# Altium project roach2_project rev2.PrjPCB (part 11 of 13)

## Sheet v6_net.SchDoc: Virtex-6 Gigabit Ethernet
size A3; Date: DO NOT USE, RATHER USE PROJ OPTIONS; DrawnBy: DO NOT USE, RATHER USE PROJ OPTIONS; Engineer: DO NOT USE, RATHER USE PROJ OPTIONS; Organization: DO NOT USE, RATHER USE PROJ OPTIONS; DocumentNumber: DO NOT USE, RATHER USE PROJ OPTIONS; Revision: DO NOT USE, RATHER USE PROJ OPTIONS; SheetNumber: 23; SheetTotal: 27; SCH_Sheet_Filename: v6_net.SchDoc; CurrentTime: DO NOT USE, RATHER USE PROJ OPTIONS; Time: DO NOT USE, RATHER USE PROJ OPTIONS; DocumentFullPathAndName: DO NOT USE, RATHER USE PROJ OPTIONS; DocumentName: DO NOT USE, RATHER USE PROJ OPTIONS; ModifiedDate: DO NOT USE, RATHER USE PROJ OPTIONS; ImagePath: DO NOT USE, RATHER USE PROJ OPTIONS
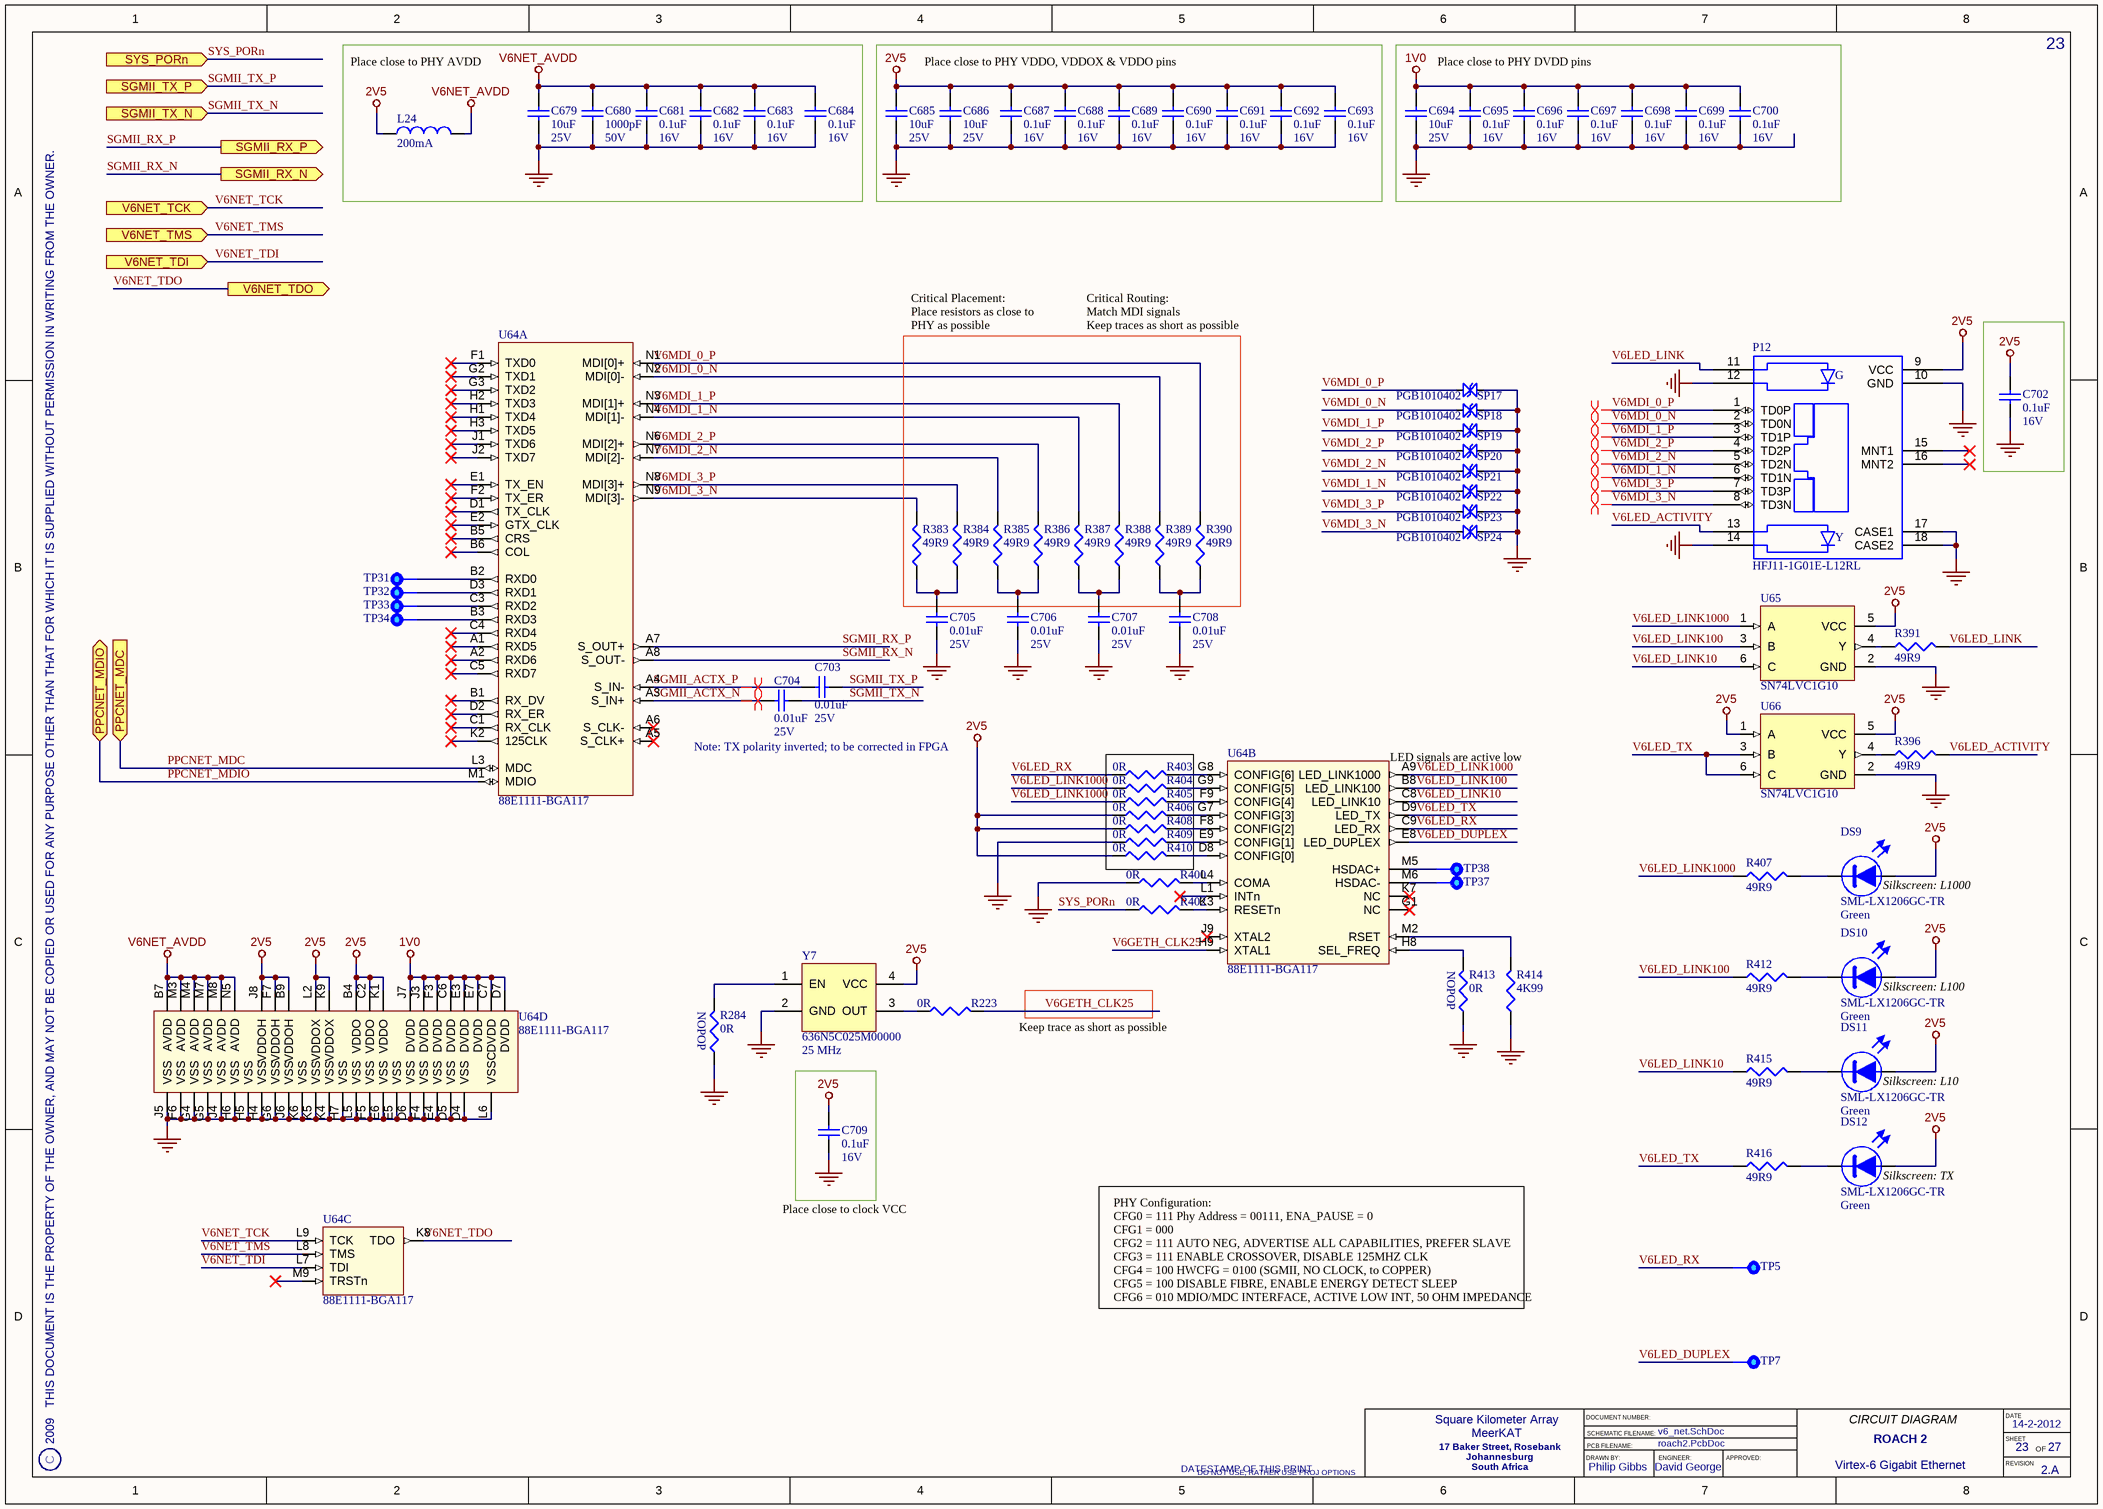
[diagram p21: v6_net.SchDoc]

### Parts
C679  Rating: 25V  [CAPC3225X200L]  (hidden comment: 10uF)
C680  Rating: 50V  [CAPC1005X55L]  (hidden comment: 1000pF)
C681  Rating: 16V  [CAPC1005X60L]  (hidden comment: 0.1uF)
C682  Rating: 16V  [CAPC1005X60L]  (hidden comment: 0.1uF)
C683  Rating: 16V  [CAPC1005X60L]  (hidden comment: 0.1uF)
C684  Rating: 16V  [CAPC1005X60L]  (hidden comment: 0.1uF)
C685  Rating: 25V  [CAPC3225X200L]  (hidden comment: 10uF)
C686  Rating: 25V  [CAPC3225X200L]  (hidden comment: 10uF)
C687  Rating: 16V  [CAPC1005X60L]  (hidden comment: 0.1uF)
C688  Rating: 16V  [CAPC1005X60L]  (hidden comment: 0.1uF)
C689  Rating: 16V  [CAPC1005X60L]  (hidden comment: 0.1uF)
C690  Rating: 16V  [CAPC1005X60L]  (hidden comment: 0.1uF)
C691  Rating: 16V  [CAPC1005X60L]  (hidden comment: 0.1uF)
C692  Rating: 16V  [CAPC1005X60L]  (hidden comment: 0.1uF)
C693  Rating: 16V  [CAPC1005X60L]  (hidden comment: 0.1uF)
C694  Rating: 25V  [CAPC3225X200L]  (hidden comment: 10uF)
C695  Rating: 16V  [CAPC1005X60L]  (hidden comment: 0.1uF)
C696  Rating: 16V  [CAPC1005X60L]  (hidden comment: 0.1uF)
C697  Rating: 16V  [CAPC1005X60L]  (hidden comment: 0.1uF)
C698  Rating: 16V  [CAPC1005X60L]  (hidden comment: 0.1uF)
C699  Rating: 16V  [CAPC1005X60L]  (hidden comment: 0.1uF)
C700  Rating: 16V  [CAPC1005X60L]  (hidden comment: 0.1uF)
C702  Rating: 16V  [CAPC1005X60L]  (hidden comment: 0.1uF)
C703  Rating: 25V  [CAPC1005X55L]  (hidden comment: 0.01uF)
C704  Rating: 25V  [CAPC1005X55L]  (hidden comment: 0.01uF)
C705  Rating: 25V  [CAPC1005X55L]  (hidden comment: 0.01uF)
C706  Rating: 25V  [CAPC1005X55L]  (hidden comment: 0.01uF)
C707  Rating: 25V  [CAPC1005X55L]  (hidden comment: 0.01uF)
C708  Rating: 25V  [CAPC1005X55L]  (hidden comment: 0.01uF)
C709  Rating: 16V  [CAPC1005X60L]  (hidden comment: 0.1uF)
DS9  SML-LX1206GC-TR  Colour: Green  [LEDC3216X120N]
DS10  SML-LX1206GC-TR  Colour: Green  [LEDC3216X120N]
DS11  SML-LX1206GC-TR  Colour: Green  [LEDC3216X120N]
DS12  SML-LX1206GC-TR  Colour: Green  [LEDC3216X120N]
L24  Rating: 200mA  [INDC2012X130L]  (hidden comment: 600R)
P12  HFJ11-1G01E-L12RL  [HALO_HFJ11-1G02E-L55]
R223  0R  [RESC1005X40L]
R284  0R  [RESC1005X40L]
R383  49R9  [RESC1005X40L]
R384  49R9  [RESC1005X40L]
R385  49R9  [RESC1005X40L]
R386  49R9  [RESC1005X40L]
R387  49R9  [RESC1005X40L]
R388  49R9  [RESC1005X40L]
R389  49R9  [RESC1005X40L]
R390  49R9  [RESC1005X40L]
R391  49R9  [RESC1005X40L]
R396  49R9  [RESC1005X40L]
R400  0R  [RESC1005X40L]
R402  0R  [RESC1005X40L]
R403  0R  [RESC1005X40L]
R404  0R  [RESC1005X40L]
R405  0R  [RESC1005X40L]
R406  0R  [RESC1005X40L]
R407  49R9  [RESC1005X40L]
R408  0R  [RESC1005X40L]
R409  0R  [RESC1005X40L]
R410  0R  [RESC1005X40L]
R412  49R9  [RESC1005X40L]
R413  0R  [RESC1005X40L]
R414  4K99  [RESC1005X40L]
R415  49R9  [RESC1005X40L]
R416  49R9  [RESC1005X40L]
SP17  PGB1010402  [PGB1010402]
SP18  PGB1010402  [PGB1010402]
SP19  PGB1010402  [PGB1010402]
SP20  PGB1010402  [PGB1010402]
SP21  PGB1010402  [PGB1010402]
SP22  PGB1010402  [PGB1010402]
SP23  PGB1010402  [PGB1010402]
SP24  PGB1010402  [PGB1010402]
TP5  Testpoint  [TP100]  (value not drawn)  (no BOM)
TP7  Testpoint  [TP100]  (value not drawn)  (no BOM)
TP31  Testpoint  [TP100]  (value not drawn)  (no BOM)
TP32  Testpoint  [TP100]  (value not drawn)  (no BOM)
TP33  Testpoint  [TP100]  (value not drawn)  (no BOM)
TP34  Testpoint  [TP100]  (value not drawn)  (no BOM)
TP37  Testpoint  [TP100]  (value not drawn)  (no BOM)
TP38  Testpoint  [TP100]  (value not drawn)  (no BOM)
U64  88E1111-BGA117  [BGA117C100P13X9_1400X1000X154]  (parts A,B,C,D of 4)
U65  SN74LVC1G10  [SOT23-6]
U66  SN74LVC1G10  [SOT23-6]
Y7  Frequency: 25 MHz  [636XXXXXXMXXXXX]  (hidden comment: 636N5C025M00000)

### Ports
PPCNET_MDC (in), PPCNET_MDIO (bidir), SGMII_RX_N (out), SGMII_RX_P (out), SGMII_TX_N (in), SGMII_TX_P (in), SYS_PORn (in), V6NET_TCK (in), V6NET_TDI (in), V6NET_TDO (out), V6NET_TMS (in)

### Nets
1V0: C694.2 C695.2 C696.2 C697.2 C698.2 C699.2 C700.2 U64.C6(DVDD) U64.C7(DVDD) U64.D7(DVDD) U64.E3(DVDD) U64.E7(DVDD) U64.F3(DVDD) U64.J3(DVDD) U64.J7(DVDD)
2V5: C685.2 C686.2 C687.2 C688.2 C689.2 C690.2 C691.2 C692.2 C693.2 C702.2 C709.2 DS9.2(A) DS10.2(A) DS11.2(A) DS12.2(A) L24.1 P12.9(VCC) R406.1 R408.1 R410.1 U64.B4(VDDO) U64.B9(VDDOH) U64.C2(VDDO) U64.F7(VDDOH) U64.J8(VDDOH) U64.K1(VDDO) U64.K9(VDDOX) U64.L2(VDDOX) U65.5(VCC) U66.1(A) U66.5(VCC) Y7.4(VCC)
GND: C679.1 C680.1 C681.1 C682.1 C683.1 C684.1 C685.1 C686.1 C687.1 C688.1 C689.1 C690.1 C691.1 C692.1 C693.1 C694.1 C695.1 C696.1 C697.1 C698.1 C699.1 C700.1 C702.1 C705.2 C706.2 C707.2 C708.2 C709.1 P12.10(GND) P12.12(R1_YA_GC) P12.14(L1_YA_GC) P12.17(CASE1) P12.18(CASE2) R284.1 R400.1 R409.1 R413.1 R414.1 SP17.1(A) SP18.1(A) SP19.1(A) SP20.1(A) SP21.1(A) SP22.1(A) SP23.1(A) SP24.1(A) U64.D4(VSS) U64.D5(VSS) U64.D6(VSS) U64.E4(VSS) U64.E5(VSS) U64.E6(VSS) U64.F4(VSS) U64.F5(VSS) U64.F6(VSS) U64.G4(VSS) U64.G5(VSS) U64.G6(VSS) U64.H4(VSS) U64.H5(VSS) U64.H6(VSS) U64.H7(VSS) U64.J4(VSS) U64.J5(VSS) U64.J6(VSS) U64.K4(VSS) U64.K5(VSS) U64.K6(VSS) U64.L5(VSS) U64.L6(VSSC) U65.2(GND) U66.2(GND) Y7.2(GND)
V6NET_AVDD: C679.2 C680.2 C681.2 C682.2 C683.2 C684.2 L24.2 U64.B7(AVDD) U64.M3(AVDD) U64.M4(AVDD) U64.M7(AVDD) U64.M8(AVDD) U64.N5(AVDD)
PPCNET_MDC: U64.L3(MDC) ; port PPCNET_MDC
PPCNET_MDIO: U64.M1(MDIO) ; port PPCNET_MDIO
SGMII_ACTX_N: C704.2 U64.A3(S_IN+)
SGMII_ACTX_P: C703.2 U64.A4(S_IN-)
SGMII_RX_N: U64.A8(S_OUT-) ; port SGMII_RX_N
SGMII_RX_P: U64.A7(S_OUT+) ; port SGMII_RX_P
SGMII_TX_N: C704.1 ; port SGMII_TX_N
SGMII_TX_P: C703.1 ; port SGMII_TX_P
SYS_PORn: R402.1 ; port SYS_PORn
V6GETH_CLK25: R223.2 U64.H9(XTAL1)
V6LED_ACTIVITY: P12.13(L1_YC_GA) R396.2
V6LED_DUPLEX: TP7.1 U64.E8(LED_DUPLEX)
V6LED_LINK: P12.11(R1_YC_GA) R391.2
V6LED_LINK10: R415.1 U64.C8(LED_LINK10) U65.6(C)
V6LED_LINK100: R412.1 U64.B8(LED_LINK100) U65.3(B)
V6LED_LINK1000: R404.1 R405.1 R407.1 U64.A9(LED_LINK1000) U65.1(A)
V6LED_RX: R403.1 TP5.1 U64.C9(LED_RX)
V6LED_TX: R416.1 U64.D9(LED_TX) U66.3(B) U66.6(C)
V6MDI_0_N: P12.2(TD0N) R389.2 SP18.2(B) U64.N2(MDI[0]-)
V6MDI_0_P: P12.1(TD0P) R390.2 SP17.2(B) U64.N1(MDI[0]+)
V6MDI_1_N: P12.6(TD1N) R387.2 SP22.2(B) U64.N4(MDI[1]-)
V6MDI_1_P: P12.3(TD1P) R388.2 SP19.2(B) U64.N3(MDI[1]+)
V6MDI_2_N: P12.5(TD2N) R385.2 SP21.2(B) U64.N7(MDI[2]-)
V6MDI_2_P: P12.4(TD2P) R386.2 SP20.2(B) U64.N6(MDI[2]+)
V6MDI_3_N: P12.8(TD3N) R383.2 SP24.2(B) U64.N9(MDI[3]-)
V6MDI_3_P: P12.7(TD3P) R384.2 SP23.2(B) U64.N8(MDI[3]+)
V6NET_TCK: U64.L9(TCK) ; port V6NET_TCK
V6NET_TDI: U64.L7(TDI) ; port V6NET_TDI
V6NET_TDO: U64.K8(TDO) ; port V6NET_TDO
V6NET_TMS: U64.L8(TMS) ; port V6NET_TMS
NetC705_1: C705.1 R383.1 R384.1
NetC706_1: C706.1 R385.1 R386.1
NetC707_1: C707.1 R387.1 R388.1
NetC708_1: C708.1 R389.1 R390.1
NetDS9_1: DS9.1(K) R407.2
NetDS10_1: DS10.1(K) R412.2
NetDS11_1: DS11.1(K) R415.2
NetDS12_1: DS12.1(K) R416.2
NetR223_1: R223.1 Y7.3(OUT)
NetR284_2: R284.2 Y7.1(EN)
NetR391_1: R391.1 U65.4(Y)
NetR396_1: R396.1 U66.4(Y)
NetR400_2: R400.2 U64.L4(COMA)
NetR402_2: R402.2 U64.K3(RESETn)
NetR403_2: R403.2 U64.G8(CONFIG[6])
NetR404_2: R404.2 U64.G9(CONFIG[5])
NetR405_2: R405.2 U64.F9(CONFIG[4])
NetR406_2: R406.2 U64.G7(CONFIG[3])
NetR408_2: R408.2 U64.F8(CONFIG[2])
NetR409_2: R409.2 U64.E9(CONFIG[1])
NetR410_2: R410.2 U64.D8(CONFIG[0])
NetR413_2: R413.2 U64.H8(SEL_FREQ)
NetR414_2: R414.2 U64.M2(RSET)
NetTP31_1: TP31.1 U64.B2(RXD0)
NetTP32_1: TP32.1 U64.D3(RXD1)
NetTP33_1: TP33.1 U64.C3(RXD2)
NetTP34_1: TP34.1 U64.B3(RXD3)
NetTP37_1: TP37.1 U64.M6(HSDAC-)
NetTP38_1: TP38.1 U64.M5(HSDAC+)

Not connected (* = marked no-connect by the designer): P12 15(MNT1)* 16(MNT2)*; U64 A1(RXD5)* A2(RXD6)* A5(S_CLK+)* A6(S_CLK-)* B1(RX_DV)* B5(CRS)* B6(COL)* C1(RX_CLK)* C4(RXD4)* C5(RXD7)* D1(TX_CLK)* D2(RX_ER)* E1(TX_EN)* E2(GTX_CLK)* F1(TXD0)* F2(TX_ER)* G1(NC)* G2(TXD1)* G3(TXD2)* H1(TXD4)* H2(TXD3)* H3(TXD5)* J1(TXD6)* J2(TXD7)* J9(XTAL2)* K2(125CLK)* K7(NC)* L1(INTn)* M9(TRSTn)*

### Layout directives
differential pair: SGMII_ACTX_N, SGMII_ACTX_P, V6MDI_0_N, V6MDI_0_P, V6MDI_1_N, V6MDI_1_P, V6MDI_2_N, V6MDI_2_P, V6MDI_3_N, V6MDI_3_P

### Notes on the sheet
- Place close to PHY AVDD
- Place close to PHY VDDO, VDDOX & VDDO pins
- Place close to PHY DVDD pins
- Critical Placement:
  Place resistors as close to
  PHY as possible
- Critical Routing:
  Match MDI signals
  Keep traces as short as possible
- Note: TX polarity inverted; to be corrected in FPGA
- (near U64) LED signals are active low
- (near DS9) Silkscreen: L1000
- (near R413) NOPOP
- (near DS10) Silkscreen: L100
- (near R284) NOPOP
- (near R223) Keep trace as short as possible
- (near DS11) Silkscreen: L10
- (near DS12) Silkscreen: TX
- Place close to clock VCC
- PHY Configuration:
  CFG0 = 111 Phy Address = 00111, ENA_PAUSE = 0
  CFG1 = 000
  CFG2 = 111 AUTO NEG, ADVERTISE ALL CAPABILITIES, PREFER SLAVE
  CFG3 = 111 ENABLE CROSSOVER, DISABLE 125MHZ CLK
  CFG4 = 100 HWCFG = 0100 (SGMII, NO CLOCK, to COPPER)
  CFG5 = 100 DISABLE FIBRE, ENABLE ENERGY DETECT SLEEP
  CFG6 = 010 MDIO/MDC INTERFACE, ACTIVE LOW INT, 50 OHM IMPEDANCE
- 2009   THIS DOCUMENT IS THE PROPERTY OF THE OWNER, AND MAY NOT BE COPIED OR USED FOR ANY PURPOSE OTHER THAN THAT FOR WHICH IT IS SUPPLIED WITHOUT PERMISSION IN WRITING FROM THE OWNER.
- C
- DATESTAMP OF THIS PRINT
- DRAWN BY:
- DOCUMENT NUMBER:
- SCHEMATIC FILENAME:
- PCB FILENAME:
- ENGINEER:
- APPROVED:
- CIRCUIT DIAGRAM
- DATE
- SHEET
- REVISION
- OF
- (in symbol CONN-PCB-4) G

### Library data of the parts
C679 C685 C686 C694 = CAP-CER-5: 10uF, Ceramic Capacitor; Manufacturer: MURATA; PartNum: GRM32DR61E106KA12L; Tolerance: 10%; Dielectric: X5R; POD number: CAP-CER-5; Value: 10uF; RoHS: Y; Sort Value: 100; Category: Capacitors; Subcategory: Ceramic
C680 = CAP-CER-4: 1000pF, Ceramic Capacitor; Manufacturer: MURATA; PartNum: GRM155R61H102KA01D; Tolerance: 10%; Dielectric: X5R; POD number: CAP-CER-4; Value: 1000pF; RoHS: Y; Sort Value: 0.0001; Category: Capacitors; Subcategory: Ceramic
C681-C684 C687-C693 C695-C700 C702 C709 = CAP-CER-1: 0.1uF, Ceramic Capacitor; Manufacturer: VENKEL; PartNum: C0402X7R160-104KN; Tolerance: 10%; Dielectric: X7R; POD number: CAP-CER-1; Value: 0.1uF; RoHS: Y; Sort Value: 0.1; Category: Capacitors; Subcategory: Ceramic
C703-C708 = CAP-CER-6: 0.01uF, Ceramic Capacitor; Manufacturer: MURATA; PartNum: GRM155R71E103KA01D; Tolerance: 10%; Dielectric: X7R; POD number: CAP-CER-6; Value: 0.01uF; RoHS: Y; Sort Value: 0.01; Category: Capacitors; Subcategory: Ceramic
DS9-DS12 = OPTO-LED-0: Green, Surface mount, LED, 1206; Manufacturer: LUMEX; Vdrop: 2.2V; Rating: 20mA; POD number: OPTO-LED-0; PartNum: SML-LX1206GC-TR; RoHS: Y; Category: OPTO; Subcategory: LED
L24 = IND-FB-0: 600 Ohm, Chip Ferrite Bead; Manufacturer: Murata; PartNum: BLM21BD601SN1; DC Res: 0.35R; Tolerance: 25%; POD number: IND-FB-0; RoHS: Y; Value: 600R; Sort Value: 600; Category: Inductors; Subcategory: FerriteBead
P12 = CONN-PCB-4: RJ45 with Integrated magnetic and dual LEDs; Manufacturer: HALO; POD number: CONN-PCB-4; PartNum: HFJ11-1G01E-L12RL; RoHS: Y; Category: CONN; Subcategory: PCB
R223 R284 R400 R402-R406 R408-R410 R413 = RES-TF-0: 0R, 1.1mm x 0.5mm, Thick Film Resistor; Manufacturer: ROYALOHM; PartNum: 0402WG00000T1E; Tolerance: 0%; Rating: 0.0625W; POD number: RES-TF-0; Value: 0R; Sort Value: 0; Category: Resistors; Subcategory: ThickFilm; HelpURL: *.pdf
R383-R391 R396 R407 R412 R415 R416 = RES-TF-10: 49R9, 1.1mm x 0.5mm, Thick Film Resistor; Manufacturer: ROYALOHM; PartNum: 0402WGF499JT1E; Tolerance: 1%; Rating: 0.0625W; POD number: RES-TF-10; Value: 49R9; Sort Value: 49.9; Category: Resistors; Subcategory: ThickFilm; HelpURL: *.pdf
R414 = RES-TF-13: 4K99, 1.1mm x 0.5mm, Thick Film Resistor; Manufacturer: ROYALOHM; PartNum: 0402WGF4991T1E; Tolerance: 1%; Rating: 0.0625W; POD number: RES-TF-13; Value: 4K99; Sort Value: 4990; Category: Resistors; Subcategory: ThickFilm; HelpURL: *.pdf
SP17-SP24 = ELMECH-ESD-3: Surface Mount Polymeric ESD Suppressor in an 0402 package; POD number: ELMECH-ESD-3; PartNum: PGB1010402
TP5 TP7 TP31-TP34 TP37 TP38 = ELMECH-TP-0: 1mm Diameter, through-hole, Circular Test-point; POD number: ELMECH-TP-0; RoHS: Y; Category: ELMECH; Subcategory: Test Points
U64 = IC-PHY-1: Integrated 10/100/1000 Ultra Gigabit Ethernet Transceiver; Manufacturer: Marvell; PartNum: 88E1111-XX-BAB1C000; POD number: IC-PHY-1; RoHS: Y; Category: IC; Subcategory: Network PHY
U65 U66 = IC-LOG-3: Single 3-input Positive-NAND gate; Manufacturer: Texas Instruments; POD number: IC-LOG-3; PartNum: SN74LVC1G10; RoHS: Y; Category: IC; Subcategory: Logic
Y7 = RESN-CLK-5: 25.00 MHz, 2V5, CTS 636 clock oscillator; Stability: 50 PPM; POD number: RESN-CLK-5; PartNum: 636N5C025M00000; Manufacturer: CTS; RoHS: Y; Category: RESN; Subcategory: Clock Oscillators

## Sheet ppc_ddr2_0.SchDoc: PowerPC DDR2 Interface
size A3; Date: DO NOT USE, RATHER USE PROJ OPTIONS; DrawnBy: DO NOT USE, RATHER USE PROJ OPTIONS; Engineer: DO NOT USE, RATHER USE PROJ OPTIONS; Organization: DO NOT USE, RATHER USE PROJ OPTIONS; DocumentNumber: DO NOT USE, RATHER USE PROJ OPTIONS; Revision: DO NOT USE, RATHER USE PROJ OPTIONS; SheetNumber: 8; SheetTotal: 27; SCH_Sheet_Filename: ppc_ddr2_0.SchDoc; CurrentTime: DO NOT USE, RATHER USE PROJ OPTIONS; Time: DO NOT USE, RATHER USE PROJ OPTIONS; DocumentFullPathAndName: DO NOT USE, RATHER USE PROJ OPTIONS; DocumentName: DO NOT USE, RATHER USE PROJ OPTIONS; ModifiedDate: DO NOT USE, RATHER USE PROJ OPTIONS; ImagePath: DO NOT USE, RATHER USE PROJ OPTIONS
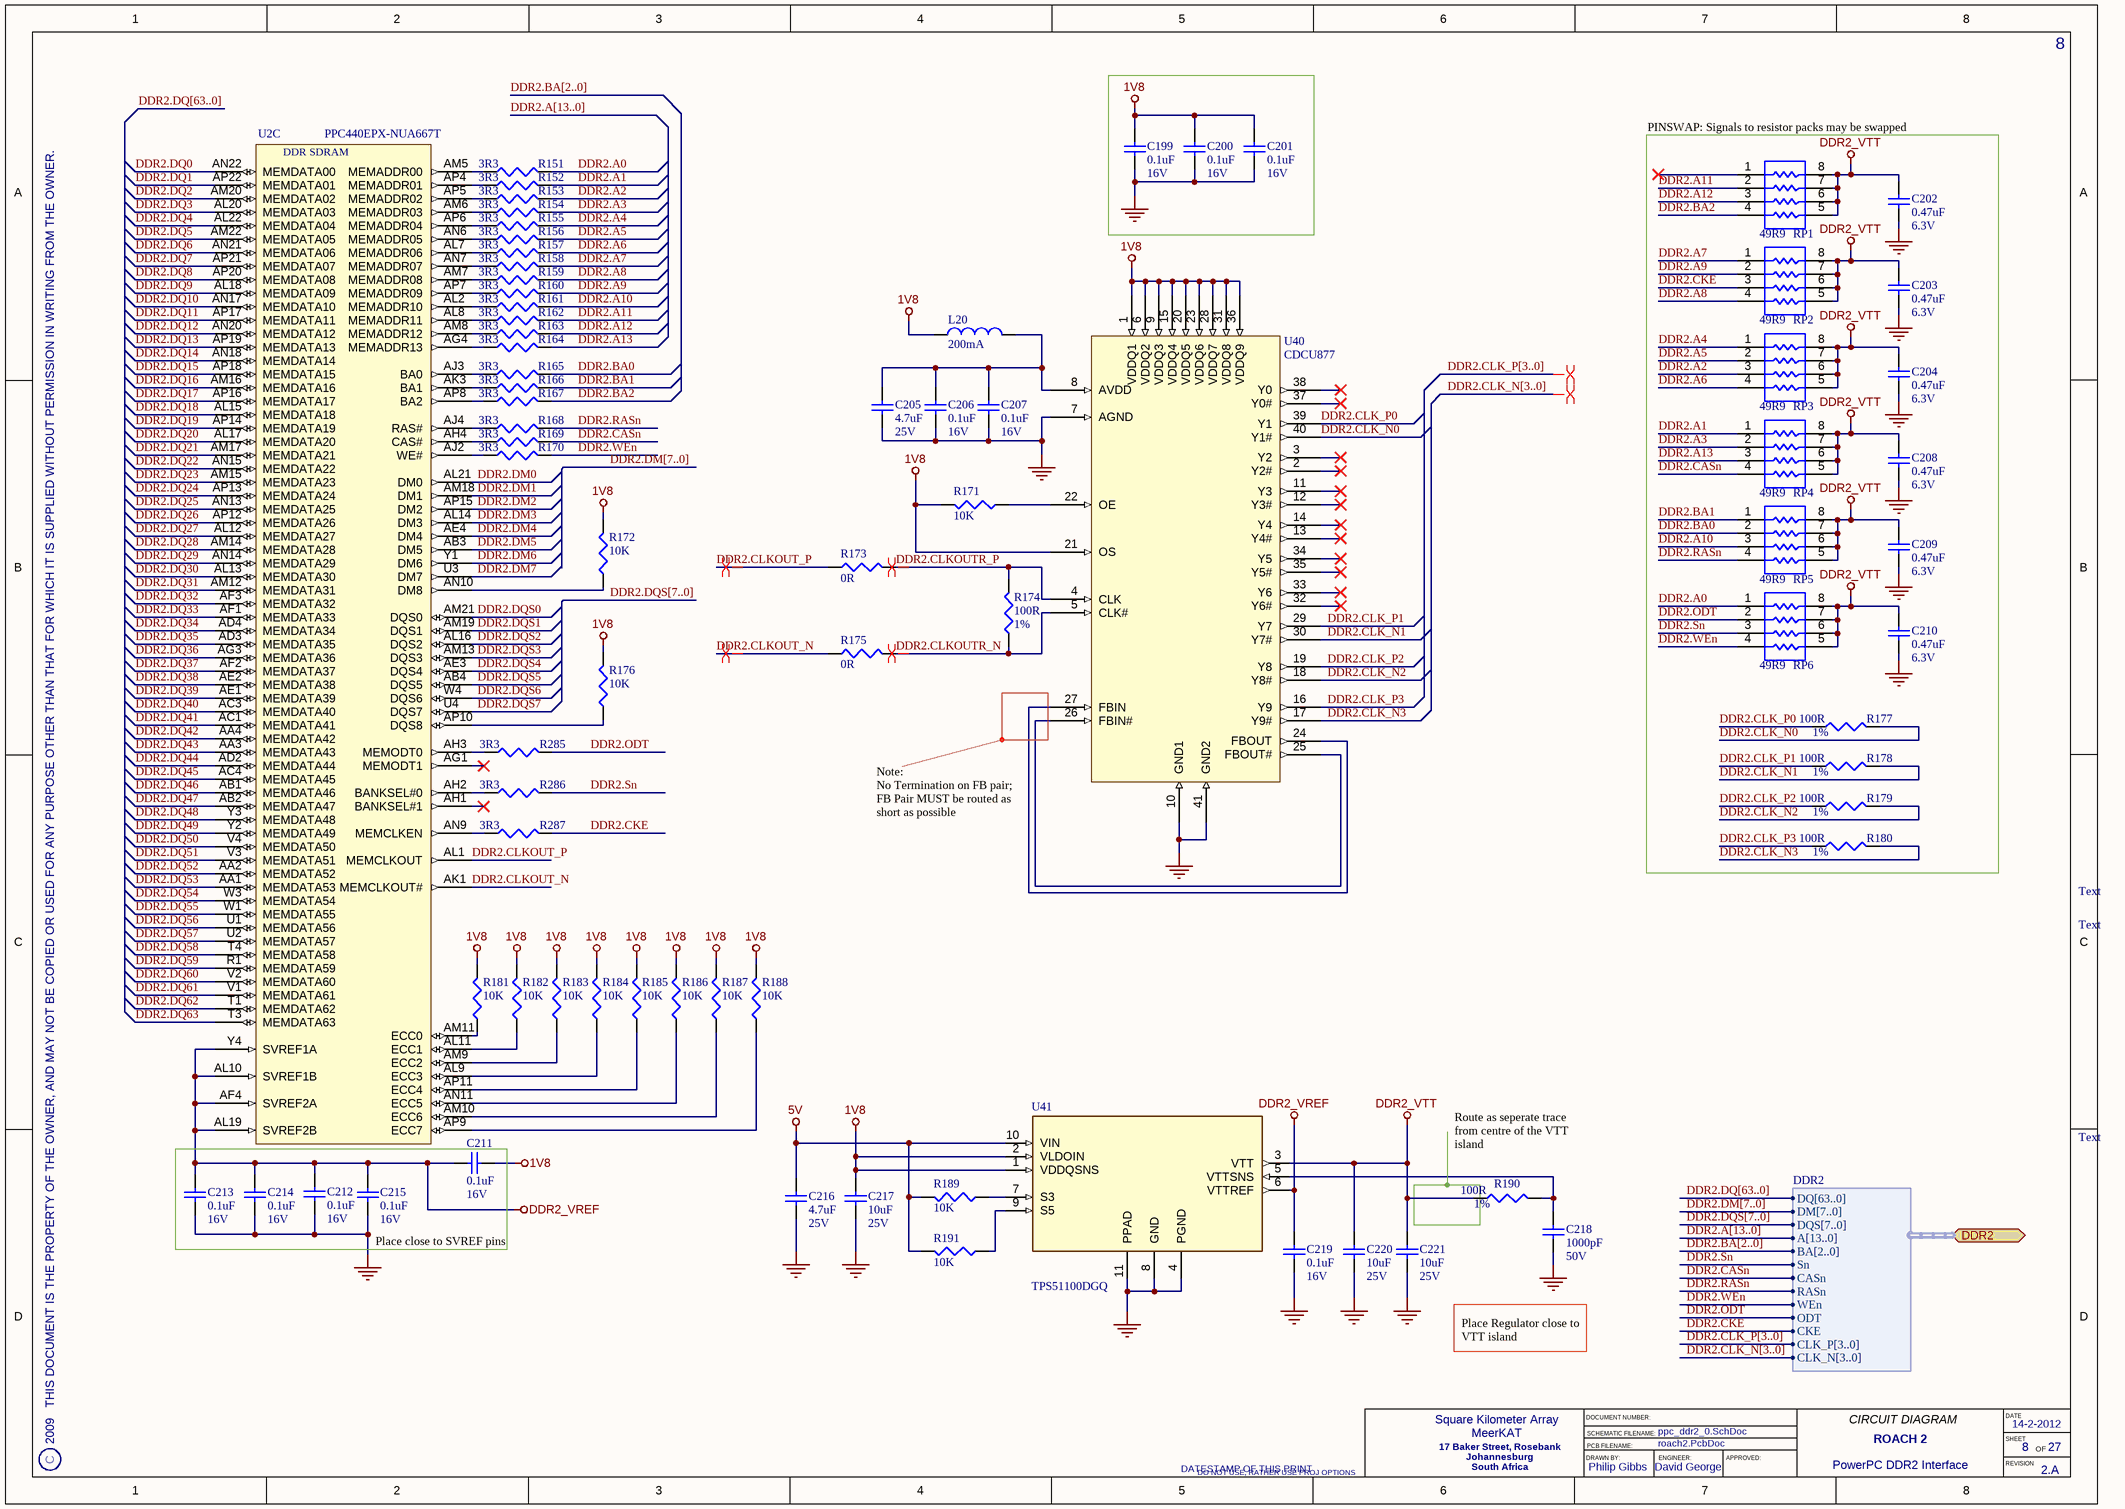
[diagram p22: ppc_ddr2_0.SchDoc]

### Parts
C199  Rating: 16V  [CAPC1005X60L]  (hidden comment: 0.1uF)
C200  Rating: 16V  [CAPC1005X60L]  (hidden comment: 0.1uF)
C201  Rating: 16V  [CAPC1005X60L]  (hidden comment: 0.1uF)
C202  Rating: 6.3V  [CAPC1005X55L]  (hidden comment: 0.47uF)
C203  Rating: 6.3V  [CAPC1005X55L]  (hidden comment: 0.47uF)
C204  Rating: 6.3V  [CAPC1005X55L]  (hidden comment: 0.47uF)
C205  Rating: 25V  [CAPC2012X127L]  (hidden comment: 4.7uF)
C206  Rating: 16V  [CAPC1005X60L]  (hidden comment: 0.1uF)
C207  Rating: 16V  [CAPC1005X60L]  (hidden comment: 0.1uF)
C208  Rating: 6.3V  [CAPC1005X55L]  (hidden comment: 0.47uF)
C209  Rating: 6.3V  [CAPC1005X55L]  (hidden comment: 0.47uF)
C210  Rating: 6.3V  [CAPC1005X55L]  (hidden comment: 0.47uF)
C211  Rating: 16V  [CAPC1005X60L]  (hidden comment: 0.1uF)
C212  Rating: 16V  [CAPC1005X60L]  (hidden comment: 0.1uF)
C213  Rating: 16V  [CAPC1005X60L]  (hidden comment: 0.1uF)
C214  Rating: 16V  [CAPC1005X60L]  (hidden comment: 0.1uF)
C215  Rating: 16V  [CAPC1005X60L]  (hidden comment: 0.1uF)
C216  Rating: 25V  [CAPC2012X127L]  (hidden comment: 4.7uF)
C217  Rating: 25V  [CAPC3225X200L]  (hidden comment: 10uF)
C218  Rating: 50V  [CAPC1005X55L]  (hidden comment: 1000pF)
C219  Rating: 16V  [CAPC1005X60L]  (hidden comment: 0.1uF)
C220  Rating: 25V  [CAPC3225X200L]  (hidden comment: 10uF)
C221  Rating: 25V  [CAPC3225X200L]  (hidden comment: 10uF)
L20  Rating: 200mA  [INDC2012X130L]  (hidden comment: 600R)
R151  3R3  [RESC1005X40L]
R152  3R3  [RESC1005X40L]
R153  3R3  [RESC1005X40L]
R154  3R3  [RESC1005X40L]
R155  3R3  [RESC1005X40L]
R156  3R3  [RESC1005X40L]
R157  3R3  [RESC1005X40L]
R158  3R3  [RESC1005X40L]
R159  3R3  [RESC1005X40L]
R160  3R3  [RESC1005X40L]
R161  3R3  [RESC1005X40L]
R162  3R3  [RESC1005X40L]
R163  3R3  [RESC1005X40L]
R164  3R3  [RESC1005X40L]
R165  3R3  [RESC1005X40L]
R166  3R3  [RESC1005X40L]
R167  3R3  [RESC1005X40L]
R168  3R3  [RESC1005X40L]
R169  3R3  [RESC1005X40L]
R170  3R3  [RESC1005X40L]
R171  10K  [RESC1005X40L]
R172  10K  [RESC1005X40L]
R173  0R  [RESC1005X40L]
R174  Tolerance: 1%  [RESC1005X40L]  (hidden comment: 100R)
R175  0R  [RESC1005X40L]
R176  10K  [RESC1005X40L]
R177  Tolerance: 1%  [RESC1005X40L]  (hidden comment: 100R)
R178  Tolerance: 1%  [RESC1005X40L]  (hidden comment: 100R)
R179  Tolerance: 1%  [RESC1005X40L]  (hidden comment: 100R)
R180  Tolerance: 1%  [RESC1005X40L]  (hidden comment: 100R)
R181  10K  [RESC1005X40L]
R182  10K  [RESC1005X40L]
R183  10K  [RESC1005X40L]
R184  10K  [RESC1005X40L]
R185  10K  [RESC1005X40L]
R186  10K  [RESC1005X40L]
R187  10K  [RESC1005X40L]
R188  10K  [RESC1005X40L]
R189  10K  [RESC1005X40L]
R190  Tolerance: 1%  [RESC1005X40L]  (hidden comment: 100R)
R191  10K  [RESC1005X40L]
R285  3R3  [RESC1005X40L]
R286  3R3  [RESC1005X40L]
R287  3R3  [RESC1005X40L]
RP1  49R9  [RESCAV50P100X200X45-8L]
RP2  49R9  [RESCAV50P100X200X45-8L]
RP3  49R9  [RESCAV50P100X200X45-8L]
RP4  49R9  [RESCAV50P100X200X45-8L]
RP5  49R9  [RESCAV50P100X200X45-8L]
RP6  49R9  [RESCAV50P100X200X45-8L]
U2  PPC440EPX-NUA667T  [TE-PBGA680]  (part C of 11)
U40  CDCU877  [TQFN-40]
U41  TPS51100DGQ  [MSOP_10-N]

### Ports
DDR2 (harness DDR2)

### Harnesses
DDR2: DQ[63..0], DM[7..0], DQS[7..0], A[13..0], BA[2..0], Sn, CASn, RASn, WEn, ODT, CKE, CLK_P[3..0], CLK_N[3..0]

### Nets
1V8: C199.2 C200.2 C201.2 C211.2 C217.2 L20.1 R171.2 R172.2 R176.2 R181.2 R182.2 R183.2 R184.2 R185.2 R186.2 R187.2 R188.2 U40.1(VDDQ1) U40.6(VDDQ2) U40.9(VDDQ3) U40.15(VDDQ4) U40.20(VDDQ5) U40.21(OS) U40.23(VDDQ6) U40.28(VDDQ7) U40.31(VDDQ8) U40.36(VDDQ9) U41.1(VDDQSNS) U41.2(VLDOIN)
5V: C216.2 R189.2 R191.2 U41.10(VIN)
DDR2_VREF: C211.1 C212.2 C213.2 C214.2 C215.2 C219.2 U2.AF4(SVREF2A) U2.AL10(SVREF1B) U2.AL19(SVREF2B) U2.Y4(SVREF1A) U41.6(VTTREF)
DDR2_VTT: C202.2 C203.2 C204.2 C208.2 C209.2 C210.2 C220.2 C221.2 R190.1 RP1.5 RP1.6 RP1.7 RP1.8 RP2.5 RP2.6 RP2.7 RP2.8 RP3.5 RP3.6 RP3.7 RP3.8 RP4.5 RP4.6 RP4.7 RP4.8 RP5.5 RP5.6 RP5.7 RP5.8 RP6.5 RP6.6 RP6.7 RP6.8 U41.3(VTT)
GND: C199.1 C200.1 C201.1 C202.1 C203.1 C204.1 C205.1 C206.1 C207.1 C208.1 C209.1 C210.1 C212.1 C213.1 C214.1 C215.1 C216.1 C217.1 C218.1 C219.1 C220.1 C221.1 U40.7(AGND) U40.10(GND1) U40.41(GND2) U41.4(PGND) U41.8(GND) U41.11(PPAD)
DDR2.A0: R151.2 RP6.1
DDR2.A1: R152.2 RP4.1
DDR2.A2: R153.2 RP3.3
DDR2.A3: R154.2 RP4.2
DDR2.A4: R155.2 RP3.1
DDR2.A5: R156.2 RP3.2
DDR2.A6: R157.2 RP3.4
DDR2.A7: R158.2 RP2.1
DDR2.A8: R159.2 RP2.4
DDR2.A9: R160.2 RP2.2
DDR2.A10: R161.2 RP5.3
DDR2.A11: R162.2 RP1.2
DDR2.A12: R163.2 RP1.3
DDR2.A13: R164.2 RP4.3
DDR2.BA0: R165.2 RP5.2
DDR2.BA1: R166.2 RP5.1
DDR2.BA2: R167.2 RP1.4
DDR2.CASn: R169.2 RP4.4 ; port DDR2.CASn
DDR2.CKE: R287.2 RP2.3 ; port DDR2.CKE
DDR2.CLK_N0: R177.2 U40.40(Y1#)
DDR2.CLK_N1: R178.2 U40.30(Y7#)
DDR2.CLK_N2: R179.2 U40.18(Y8#)
DDR2.CLK_N3: R180.2 U40.17(Y9#)
DDR2.CLK_P0: R177.1 U40.39(Y1)
DDR2.CLK_P1: R178.1 U40.29(Y7)
DDR2.CLK_P2: R179.1 U40.19(Y8)
DDR2.CLK_P3: R180.1 U40.16(Y9)
DDR2.CLKOUT_N: R175.1 U2.AK1(MEMCLKOUT#)
DDR2.CLKOUT_P: R173.1 U2.AL1(MEMCLKOUT)
DDR2.CLKOUTR_N: R174.1 R175.2 U40.5(CLK#)
DDR2.CLKOUTR_P: R173.2 R174.2 U40.4(CLK)
DDR2.DM0: U2.AL21(DM0)
DDR2.DM1: U2.AM18(DM1)
DDR2.DM2: U2.AP15(DM2)
DDR2.DM3: U2.AL14(DM3)
DDR2.DM4: U2.AE4(DM4)
DDR2.DM5: U2.AB3(DM5)
DDR2.DM6: U2.Y1(DM6)
DDR2.DM7: U2.U3(DM7)
DDR2.DQ0: U2.AN22(MEMDATA00)
DDR2.DQ1: U2.AP22(MEMDATA01)
DDR2.DQ2: U2.AM20(MEMDATA02)
DDR2.DQ3: U2.AL20(MEMDATA03)
DDR2.DQ4: U2.AL22(MEMDATA04)
DDR2.DQ5: U2.AM22(MEMDATA05)
DDR2.DQ6: U2.AN21(MEMDATA06)
DDR2.DQ7: U2.AP21(MEMDATA07)
DDR2.DQ8: U2.AP20(MEMDATA08)
DDR2.DQ9: U2.AL18(MEMDATA09)
DDR2.DQ10: U2.AN17(MEMDATA10)
DDR2.DQ11: U2.AP17(MEMDATA11)
DDR2.DQ12: U2.AN20(MEMDATA12)
DDR2.DQ13: U2.AP19(MEMDATA13)
DDR2.DQ14: U2.AN18(MEMDATA14)
DDR2.DQ15: U2.AP18(MEMDATA15)
DDR2.DQ16: U2.AM16(MEMDATA16)
DDR2.DQ17: U2.AP16(MEMDATA17)
DDR2.DQ18: U2.AL15(MEMDATA18)
DDR2.DQ19: U2.AP14(MEMDATA19)
DDR2.DQ20: U2.AL17(MEMDATA20)
DDR2.DQ21: U2.AM17(MEMDATA21)
DDR2.DQ22: U2.AN15(MEMDATA22)
DDR2.DQ23: U2.AM15(MEMDATA23)
DDR2.DQ24: U2.AP13(MEMDATA24)
DDR2.DQ25: U2.AN13(MEMDATA25)
DDR2.DQ26: U2.AP12(MEMDATA26)
DDR2.DQ27: U2.AL12(MEMDATA27)
DDR2.DQ28: U2.AM14(MEMDATA28)
DDR2.DQ29: U2.AN14(MEMDATA29)
DDR2.DQ30: U2.AL13(MEMDATA30)
DDR2.DQ31: U2.AM12(MEMDATA31)
DDR2.DQ32: U2.AF3(MEMDATA32)
DDR2.DQ33: U2.AF1(MEMDATA33)
DDR2.DQ34: U2.AD4(MEMDATA34)
DDR2.DQ35: U2.AD3(MEMDATA35)
DDR2.DQ36: U2.AG3(MEMDATA36)
DDR2.DQ37: U2.AF2(MEMDATA37)
DDR2.DQ38: U2.AE2(MEMDATA38)
DDR2.DQ39: U2.AE1(MEMDATA39)
DDR2.DQ40: U2.AC3(MEMDATA40)
DDR2.DQ41: U2.AC1(MEMDATA41)
DDR2.DQ42: U2.AA4(MEMDATA42)
DDR2.DQ43: U2.AA3(MEMDATA43)
DDR2.DQ44: U2.AD2(MEMDATA44)
DDR2.DQ45: U2.AC4(MEMDATA45)
DDR2.DQ46: U2.AB1(MEMDATA46)
DDR2.DQ47: U2.AB2(MEMDATA47)
DDR2.DQ48: U2.Y3(MEMDATA48)
DDR2.DQ49: U2.Y2(MEMDATA49)
DDR2.DQ50: U2.V4(MEMDATA50)
DDR2.DQ51: U2.V3(MEMDATA51)
DDR2.DQ52: U2.AA2(MEMDATA52)
DDR2.DQ53: U2.AA1(MEMDATA53)
DDR2.DQ54: U2.W3(MEMDATA54)
DDR2.DQ55: U2.W1(MEMDATA55)
DDR2.DQ56: U2.U1(MEMDATA56)
DDR2.DQ57: U2.U2(MEMDATA57)
DDR2.DQ58: U2.T4(MEMDATA58)
DDR2.DQ59: U2.R1(MEMDATA59)
DDR2.DQ60: U2.V2(MEMDATA60)
DDR2.DQ61: U2.V1(MEMDATA61)
DDR2.DQ62: U2.T1(MEMDATA62)
DDR2.DQ63: U2.T3(MEMDATA63)
DDR2.DQS0: U2.AM21(DQS0)
DDR2.DQS1: U2.AM19(DQS1)
DDR2.DQS2: U2.AL16(DQS2)
DDR2.DQS3: U2.AM13(DQS3)
DDR2.DQS4: U2.AE3(DQS4)
DDR2.DQS5: U2.AB4(DQS5)
DDR2.DQS6: U2.W4(DQS6)
DDR2.DQS7: U2.U4(DQS7)
DDR2.ODT: R285.2 RP6.2 ; port DDR2.ODT
DDR2.RASn: R168.2 RP5.4 ; port DDR2.RASn
DDR2.Sn: R286.2 RP6.3 ; port DDR2.Sn
DDR2.WEn: R170.2 RP6.4 ; port DDR2.WEn
NetC205_2: C205.2 C206.2 C207.2 L20.2 U40.8(AVDD)
NetC218_2: C218.2 R190.2 U41.5(VTTSNS)
NetR151_1: R151.1 U2.AM5(MEMADDR00)
NetR152_1: R152.1 U2.AP4(MEMADDR01)
NetR153_1: R153.1 U2.AP5(MEMADDR02)
NetR154_1: R154.1 U2.AM6(MEMADDR03)
NetR155_1: R155.1 U2.AP6(MEMADDR04)
NetR156_1: R156.1 U2.AN6(MEMADDR05)
NetR157_1: R157.1 U2.AL7(MEMADDR06)
NetR158_1: R158.1 U2.AN7(MEMADDR07)
NetR159_1: R159.1 U2.AM7(MEMADDR08)
NetR160_1: R160.1 U2.AP7(MEMADDR09)
NetR161_1: R161.1 U2.AL2(MEMADDR10)
NetR162_1: R162.1 U2.AL8(MEMADDR11)
NetR163_1: R163.1 U2.AM8(MEMADDR12)
NetR164_1: R164.1 U2.AG4(MEMADDR13)
NetR165_1: R165.1 U2.AJ3(BA0)
NetR166_1: R166.1 U2.AK3(BA1)
NetR167_1: R167.1 U2.AP8(BA2)
NetR168_1: R168.1 U2.AJ4(RAS#)
NetR169_1: R169.1 U2.AH4(CAS#)
NetR170_1: R170.1 U2.AJ2(WE#)
NetR171_1: R171.1 U40.22(OE)
NetR172_1: R172.1 U2.AN10(DM8)
NetR176_1: R176.1 U2.AP10(DQS8)
NetR181_1: R181.1 U2.AM11(ECC0)
NetR182_1: R182.1 U2.AL11(ECC1)
NetR183_1: R183.1 U2.AM9(ECC2)
NetR184_1: R184.1 U2.AL9(ECC3)
NetR185_1: R185.1 U2.AP11(ECC4)
NetR186_1: R186.1 U2.AN11(ECC5)
NetR187_1: R187.1 U2.AM10(ECC6)
NetR188_1: R188.1 U2.AP9(ECC7)
NetR189_1: R189.1 U41.7(S3)
NetR191_1: R191.1 U41.9(S5)
NetR285_1: R285.1 U2.AH3(MEMODT0)
NetR286_1: R286.1 U2.AH2(BANKSEL#0)
NetR287_1: R287.1 U2.AN9(MEMCLKEN)
NetU40_24: U40.24(FBOUT) U40.27(FBIN)
NetU40_25: U40.25(FBOUT#) U40.26(FBIN#)

Not connected (* = marked no-connect by the designer): RP1 1*; U2 AG1(MEMODT1)* AH1(BANKSEL#1)*; U40 2(Y2#)* 3(Y2)* 11(Y3)* 12(Y3#)* 13(Y4#)* 14(Y4)* 32(Y6#)* 33(Y6)* 34(Y5)* 35(Y5#)* 37(Y0#)* 38(Y0)*

### Buses and harness runs
bus DDR2.A[13..0]
bus DDR2.BA[2..0]
bus DDR2.CLK_N[3..0]
bus DDR2.CLK_P[3..0]
bus DDR2.DM[7..0]
bus DDR2.DQ[63..0]
bus DDR2.DQS[7..0]

### Layout directives
differential pair: (no net found under the mark), DDR2.CLKOUT_N, DDR2.CLKOUT_P, DDR2.CLKOUTR_N, DDR2.CLKOUTR_P

### Notes on the sheet
- (near RP1) PINSWAP: Signals to resistor packs may be swapped
- Note:
  No Termination on FB pair;
  FB Pair MUST be routed as short as possible
- Text
- Route as seperate trace from centre of the VTT island
- (near C215) Place close to SVREF pins
- Place Regulator close to VTT island
- 2009   THIS DOCUMENT IS THE PROPERTY OF THE OWNER, AND MAY NOT BE COPIED OR USED FOR ANY PURPOSE OTHER THAN THAT FOR WHICH IT IS SUPPLIED WITHOUT PERMISSION IN WRITING FROM THE OWNER.
- C
- DATESTAMP OF THIS PRINT
- DRAWN BY:
- DOCUMENT NUMBER:
- SCHEMATIC FILENAME:
- PCB FILENAME:
- ENGINEER:
- APPROVED:
- CIRCUIT DIAGRAM
- DATE
- SHEET
- REVISION
- OF
- (in symbol IC-CPU-1, part C) DDR SDRAM

### Library data of the parts
C199-C201 C206 C207 C211-C215 C219 = CAP-CER-1: as C681-C684 on sheet v6_net; POD number: CAP-CER-1; Value: 0.1uF; RoHS: Y; Sort Value: 0.1; Category: Capacitors; Subcategory: Ceramic
C202-C204 C208-C210 = CAP-CER-7: 0.47uF, Ceramic Capacitor; Manufacturer: MURATA; PartNum: GRM155R60J474KE19; Tolerance: 10%; Dielectric: X5R; POD number: CAP-CER-7; Value: 0.47uF; RoHS: Y; Sort Value: 0.47; Category: Capacitors; Subcategory: Ceramic
C205 C216 = CAP-CER-3: 4.7uF, Ceramic Capacitor; Manufacturer: MURATA; PartNum: GRM21BR61E475KA12K; Tolerance: 10%; Dielectric: X5R; POD number: CAP-CER-3; Value: 4.7uF; RoHS: Y; Sort Value: 4.7; Category: Capacitors; Subcategory: Ceramic
C217 C220 C221 = CAP-CER-5: as C679 on sheet v6_net; POD number: CAP-CER-5; Value: 10uF; RoHS: Y; Sort Value: 100; Category: Capacitors; Subcategory: Ceramic
C218 = CAP-CER-4: as C680 on sheet v6_net; POD number: CAP-CER-4; Value: 1000pF; RoHS: Y; Sort Value: 0.0001; Category: Capacitors; Subcategory: Ceramic
L20 = IND-FB-0: as L24 on sheet v6_net; POD number: IND-FB-0; RoHS: Y; Value: 600R; Sort Value: 600; Category: Inductors; Subcategory: FerriteBead
R151-R170 R285-R287 = RES-TF-24: 3R3, 1.1mm x 0.5mm, Thick Film Resistor; Manufacturer: ROYALOHM; PartNum: 0402WGJ330KT1E; Tolerance: 5%; Rating: 0.0625W; POD number: RES-TF-24; Value: 3R3; Sort Value: 3R3; Category: Resistors; Subcategory: ThickFilm; HelpURL: *.pdf
R171 R172 R176 R181-R189 R191 = RES-TF-5: 10K, 1.1mm x 0.5mm, Thick Film Resistor; Manufacturer: ROYALOHM; PartNum: 0402WGJ0103T1E; Tolerance: 5%; Rating: 0.0625W; POD number: RES-TF-5; Value: 10K; Sort Value: 10000; Category: Resistors; Subcategory: ThickFilm; HelpURL: *.pdf
R173 R175 = RES-TF-0: as R223 on sheet v6_net; POD number: RES-TF-0; Value: 0R; Sort Value: 0; Category: Resistors; Subcategory: ThickFilm; HelpURL: *.pdf
R174 R177-R180 R190 = RES-TF-14: 100R, 1.1mm x 0.5mm, Thick Film Resistor; Manufacturer: ROYALOHM; PartNum: 0402WGF0101T1E; Rating: 0.0625W; POD number: RES-TF-14; Value: 100R; Sort Value: 1000; Category: Resistors; Subcategory: ThickFilm; HelpURL: *.pdf
RP1-RP6 = RES-TF-39: 4-Wide, Isolated, Thick Film Resistor Network; Manufacturer: ROYALOHM; PartNum: 4D02WGJ0510B1E; Tolerance: 1%; Rating: 0.0625W; POD number: RES-TF-39; Value: 49R9; Sort Value: 49.9; Category: Resistors; Subcategory: ThickFilm
U2 = IC-CPU-1: 667MHz, non-RoHS, PPC440EPx uProcessor; Manufacturer: Applied Micro; POD number: IC-CPU-1; PartNum: PPC440EPX-NUA667T; RoHS: Y; Category: IC; Subcategory: CPU
U40 = IC-LOG-15: SSTL Zero-Delay Clock Buffer; Manufacturer: Texas Instruments; POD number: IC-LOG-15; PartNum: CDCU877; RoHS: Y; Category: IC; Subcategory: Logic
U41 = IC-REG-6: 3A Sink/Source Regulator; Manufacturer: Texas Instruments; POD number: IC-REG-6; PartNum: TPS51100DGQ; RoHS: Y; Category: IC; Subcategory: Regulators

## Sheet ppc_ddr2_1.SchDoc: PowerPC DDR2 SDRAM Circuits
size A3; Date: DO NOT USE, RATHER USE PROJ OPTIONS; DrawnBy: DO NOT USE, RATHER USE PROJ OPTIONS; Engineer: DO NOT USE, RATHER USE PROJ OPTIONS; Organization: DO NOT USE, RATHER USE PROJ OPTIONS; DocumentNumber: DO NOT USE, RATHER USE PROJ OPTIONS; Revision: DO NOT USE, RATHER USE PROJ OPTIONS; SheetNumber: 9; SheetTotal: 27; SCH_Sheet_Filename: ppc_ddr2_1.SchDoc; CurrentTime: DO NOT USE, RATHER USE PROJ OPTIONS; Time: DO NOT USE, RATHER USE PROJ OPTIONS; DocumentFullPathAndName: DO NOT USE, RATHER USE PROJ OPTIONS; DocumentName: DO NOT USE, RATHER USE PROJ OPTIONS; ModifiedDate: DO NOT USE, RATHER USE PROJ OPTIONS; ImagePath: DO NOT USE, RATHER USE PROJ OPTIONS
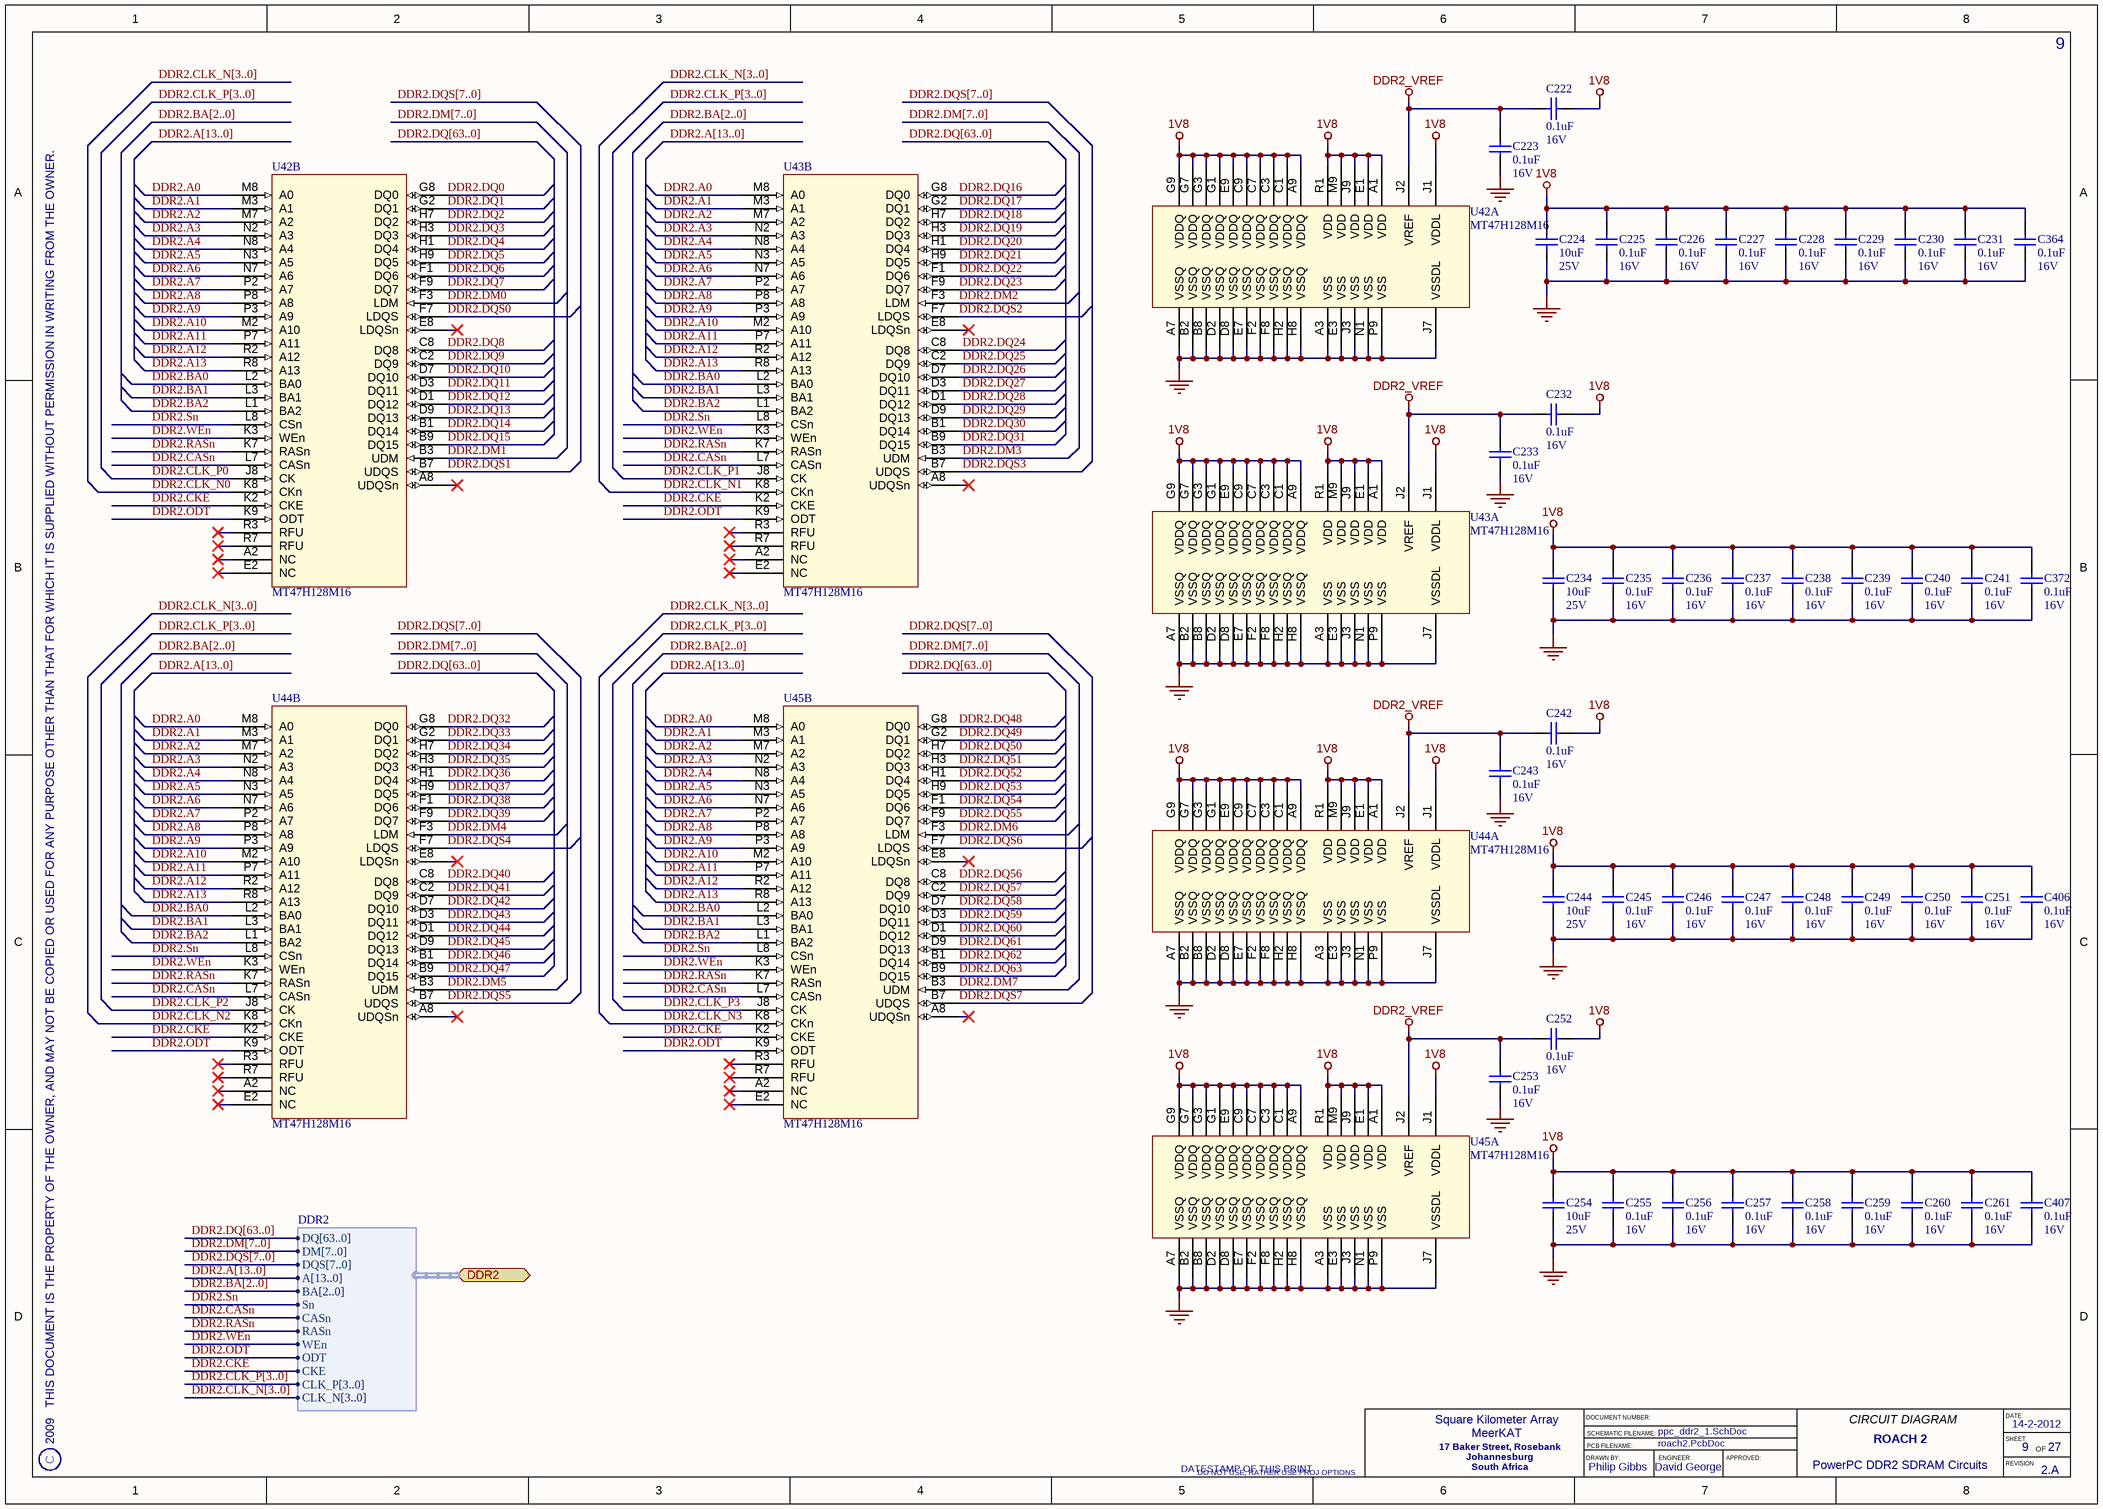
[diagram p23: ppc_ddr2_1.SchDoc]

### Parts
C222  Rating: 16V  [CAPC1005X60L]  (hidden comment: 0.1uF)
C223  Rating: 16V  [CAPC1005X60L]  (hidden comment: 0.1uF)
C224  Rating: 25V  [CAPC3225X200L]  (hidden comment: 10uF)
C225  Rating: 16V  [CAPC1005X60L]  (hidden comment: 0.1uF)
C226  Rating: 16V  [CAPC1005X60L]  (hidden comment: 0.1uF)
C227  Rating: 16V  [CAPC1005X60L]  (hidden comment: 0.1uF)
C228  Rating: 16V  [CAPC1005X60L]  (hidden comment: 0.1uF)
C229  Rating: 16V  [CAPC1005X60L]  (hidden comment: 0.1uF)
C230  Rating: 16V  [CAPC1005X60L]  (hidden comment: 0.1uF)
C231  Rating: 16V  [CAPC1005X60L]  (hidden comment: 0.1uF)
C232  Rating: 16V  [CAPC1005X60L]  (hidden comment: 0.1uF)
C233  Rating: 16V  [CAPC1005X60L]  (hidden comment: 0.1uF)
C234  Rating: 25V  [CAPC3225X200L]  (hidden comment: 10uF)
C235  Rating: 16V  [CAPC1005X60L]  (hidden comment: 0.1uF)
C236  Rating: 16V  [CAPC1005X60L]  (hidden comment: 0.1uF)
C237  Rating: 16V  [CAPC1005X60L]  (hidden comment: 0.1uF)
C238  Rating: 16V  [CAPC1005X60L]  (hidden comment: 0.1uF)
C239  Rating: 16V  [CAPC1005X60L]  (hidden comment: 0.1uF)
C240  Rating: 16V  [CAPC1005X60L]  (hidden comment: 0.1uF)
C241  Rating: 16V  [CAPC1005X60L]  (hidden comment: 0.1uF)
C242  Rating: 16V  [CAPC1005X60L]  (hidden comment: 0.1uF)
C243  Rating: 16V  [CAPC1005X60L]  (hidden comment: 0.1uF)
C244  Rating: 25V  [CAPC3225X200L]  (hidden comment: 10uF)
C245  Rating: 16V  [CAPC1005X60L]  (hidden comment: 0.1uF)
C246  Rating: 16V  [CAPC1005X60L]  (hidden comment: 0.1uF)
C247  Rating: 16V  [CAPC1005X60L]  (hidden comment: 0.1uF)
C248  Rating: 16V  [CAPC1005X60L]  (hidden comment: 0.1uF)
C249  Rating: 16V  [CAPC1005X60L]  (hidden comment: 0.1uF)
C250  Rating: 16V  [CAPC1005X60L]  (hidden comment: 0.1uF)
C251  Rating: 16V  [CAPC1005X60L]  (hidden comment: 0.1uF)
C252  Rating: 16V  [CAPC1005X60L]  (hidden comment: 0.1uF)
C253  Rating: 16V  [CAPC1005X60L]  (hidden comment: 0.1uF)
C254  Rating: 25V  [CAPC3225X200L]  (hidden comment: 10uF)
C255  Rating: 16V  [CAPC1005X60L]  (hidden comment: 0.1uF)
C256  Rating: 16V  [CAPC1005X60L]  (hidden comment: 0.1uF)
C257  Rating: 16V  [CAPC1005X60L]  (hidden comment: 0.1uF)
C258  Rating: 16V  [CAPC1005X60L]  (hidden comment: 0.1uF)
C259  Rating: 16V  [CAPC1005X60L]  (hidden comment: 0.1uF)
C260  Rating: 16V  [CAPC1005X60L]  (hidden comment: 0.1uF)
C261  Rating: 16V  [CAPC1005X60L]  (hidden comment: 0.1uF)
C364  Rating: 16V  [CAPC1005X60L]  (hidden comment: 0.1uF)
C372  Rating: 16V  [CAPC1005X60L]  (hidden comment: 0.1uF)
C406  Rating: 16V  [CAPC1005X60L]  (hidden comment: 0.1uF)
C407  Rating: 16V  [CAPC1005X60L]  (hidden comment: 0.1uF)
U42  MT47H128M16  [DDR2_BGA84]  (parts A,B of 2)
U43  MT47H128M16  [DDR2_BGA84]  (parts A,B of 2)
U44  MT47H128M16  [DDR2_BGA84]  (parts A,B of 2)
U45  MT47H128M16  [DDR2_BGA84]  (parts A,B of 2)

### Ports
DDR2 (harness DDR2)

### Harnesses
DDR2: DQ[63..0], DM[7..0], DQS[7..0], A[13..0], BA[2..0], Sn, CASn, RASn, WEn, ODT, CKE, CLK_P[3..0], CLK_N[3..0]

### Nets
1V8: C222.1 C224.2 C225.2 C226.2 C227.2 C228.2 C229.2 C230.2 C231.2 C232.1 C234.2 C235.2 C236.2 C237.2 C238.2 C239.2 C240.2 C241.2 C242.1 C244.2 C245.2 C246.2 C247.2 C248.2 C249.2 C250.2 C251.2 C252.1 C254.2 C255.2 C256.2 C257.2 C258.2 C259.2 C260.2 C261.2 C364.2 C372.2 C406.2 C407.2 U42.A1(VDD) U42.A9(VDDQ) U42.C1(VDDQ) U42.C3(VDDQ) U42.C7(VDDQ) U42.C9(VDDQ) U42.E1(VDD) U42.E9(VDDQ) U42.G1(VDDQ) U42.G3(VDDQ) U42.G7(VDDQ) U42.G9(VDDQ) U42.J1(VDDL) U42.J9(VDD) U42.M9(VDD) U42.R1(VDD) U43.A1(VDD) U43.A9(VDDQ) U43.C1(VDDQ) U43.C3(VDDQ) U43.C7(VDDQ) U43.C9(VDDQ) U43.E1(VDD) U43.E9(VDDQ) U43.G1(VDDQ) U43.G3(VDDQ) U43.G7(VDDQ) U43.G9(VDDQ) U43.J1(VDDL) U43.J9(VDD) U43.M9(VDD) U43.R1(VDD) U44.A1(VDD) U44.A9(VDDQ) U44.C1(VDDQ) U44.C3(VDDQ) U44.C7(VDDQ) U44.C9(VDDQ) U44.E1(VDD) U44.E9(VDDQ) U44.G1(VDDQ) U44.G3(VDDQ) U44.G7(VDDQ) U44.G9(VDDQ) U44.J1(VDDL) U44.J9(VDD) U44.M9(VDD) U44.R1(VDD) U45.A1(VDD) U45.A9(VDDQ) U45.C1(VDDQ) U45.C3(VDDQ) U45.C7(VDDQ) U45.C9(VDDQ) U45.E1(VDD) U45.E9(VDDQ) U45.G1(VDDQ) U45.G3(VDDQ) U45.G7(VDDQ) U45.G9(VDDQ) U45.J1(VDDL) U45.J9(VDD) U45.M9(VDD) U45.R1(VDD)
DDR2_VREF: C222.2 C223.2 C232.2 C233.2 C242.2 C243.2 C252.2 C253.2 U42.J2(VREF) U43.J2(VREF) U44.J2(VREF) U45.J2(VREF)
GND: C223.1 C224.1 C225.1 C226.1 C227.1 C228.1 C229.1 C230.1 C231.1 C233.1 C234.1 C235.1 C236.1 C237.1 C238.1 C239.1 C240.1 C241.1 C243.1 C244.1 C245.1 C246.1 C247.1 C248.1 C249.1 C250.1 C251.1 C253.1 C254.1 C255.1 C256.1 C257.1 C258.1 C259.1 C260.1 C261.1 C364.1 C372.1 C406.1 C407.1 U42.A3(VSS) U42.A7(VSSQ) U42.B2(VSSQ) U42.B8(VSSQ) U42.D2(VSSQ) U42.D8(VSSQ) U42.E3(VSS) U42.E7(VSSQ) U42.F2(VSSQ) U42.F8(VSSQ) U42.H2(VSSQ) U42.H8(VSSQ) U42.J3(VSS) U42.J7(VSSDL) U42.N1(VSS) U42.P9(VSS) U43.A3(VSS) U43.A7(VSSQ) U43.B2(VSSQ) U43.B8(VSSQ) U43.D2(VSSQ) U43.D8(VSSQ) U43.E3(VSS) U43.E7(VSSQ) U43.F2(VSSQ) U43.F8(VSSQ) U43.H2(VSSQ) U43.H8(VSSQ) U43.J3(VSS) U43.J7(VSSDL) U43.N1(VSS) U43.P9(VSS) U44.A3(VSS) U44.A7(VSSQ) U44.B2(VSSQ) U44.B8(VSSQ) U44.D2(VSSQ) U44.D8(VSSQ) U44.E3(VSS) U44.E7(VSSQ) U44.F2(VSSQ) U44.F8(VSSQ) U44.H2(VSSQ) U44.H8(VSSQ) U44.J3(VSS) U44.J7(VSSDL) U44.N1(VSS) U44.P9(VSS) U45.A3(VSS) U45.A7(VSSQ) U45.B2(VSSQ) U45.B8(VSSQ) U45.D2(VSSQ) U45.D8(VSSQ) U45.E3(VSS) U45.E7(VSSQ) U45.F2(VSSQ) U45.F8(VSSQ) U45.H2(VSSQ) U45.H8(VSSQ) U45.J3(VSS) U45.J7(VSSDL) U45.N1(VSS) U45.P9(VSS)
DDR2.A0: U42.M8(A0) U43.M8(A0) U44.M8(A0) U45.M8(A0)
DDR2.A1: U42.M3(A1) U43.M3(A1) U44.M3(A1) U45.M3(A1)
DDR2.A2: U42.M7(A2) U43.M7(A2) U44.M7(A2) U45.M7(A2)
DDR2.A3: U42.N2(A3) U43.N2(A3) U44.N2(A3) U45.N2(A3)
DDR2.A4: U42.N8(A4) U43.N8(A4) U44.N8(A4) U45.N8(A4)
DDR2.A5: U42.N3(A5) U43.N3(A5) U44.N3(A5) U45.N3(A5)
DDR2.A6: U42.N7(A6) U43.N7(A6) U44.N7(A6) U45.N7(A6)
DDR2.A7: U42.P2(A7) U43.P2(A7) U44.P2(A7) U45.P2(A7)
DDR2.A8: U42.P8(A8) U43.P8(A8) U44.P8(A8) U45.P8(A8)
DDR2.A9: U42.P3(A9) U43.P3(A9) U44.P3(A9) U45.P3(A9)
DDR2.A10: U42.M2(A10) U43.M2(A10) U44.M2(A10) U45.M2(A10)
DDR2.A11: U42.P7(A11) U43.P7(A11) U44.P7(A11) U45.P7(A11)
DDR2.A12: U42.R2(A12) U43.R2(A12) U44.R2(A12) U45.R2(A12)
DDR2.A13: U42.R8(A13) U43.R8(A13) U44.R8(A13) U45.R8(A13)
DDR2.BA0: U42.L2(BA0) U43.L2(BA0) U44.L2(BA0) U45.L2(BA0)
DDR2.BA1: U42.L3(BA1) U43.L3(BA1) U44.L3(BA1) U45.L3(BA1)
DDR2.BA2: U42.L1(BA2) U43.L1(BA2) U44.L1(BA2) U45.L1(BA2)
DDR2.CASn: U42.L7(CASn) U43.L7(CASn) U44.L7(CASn) U45.L7(CASn) ; port DDR2.CASn
DDR2.CKE: U42.K2(CKE) U43.K2(CKE) U44.K2(CKE) U45.K2(CKE) ; port DDR2.CKE
DDR2.CLK_N0: U42.K8(CKn)
DDR2.CLK_N1: U43.K8(CKn)
DDR2.CLK_N2: U44.K8(CKn)
DDR2.CLK_N3: U45.K8(CKn)
DDR2.CLK_P0: U42.J8(CK)
DDR2.CLK_P1: U43.J8(CK)
DDR2.CLK_P2: U44.J8(CK)
DDR2.CLK_P3: U45.J8(CK)
DDR2.DM0: U42.F3(LDM)
DDR2.DM1: U42.B3(UDM)
DDR2.DM2: U43.F3(LDM)
DDR2.DM3: U43.B3(UDM)
DDR2.DM4: U44.F3(LDM)
DDR2.DM5: U44.B3(UDM)
DDR2.DM6: U45.F3(LDM)
DDR2.DM7: U45.B3(UDM)
DDR2.DQ0: U42.G8(DQ0)
DDR2.DQ1: U42.G2(DQ1)
DDR2.DQ2: U42.H7(DQ2)
DDR2.DQ3: U42.H3(DQ3)
DDR2.DQ4: U42.H1(DQ4)
DDR2.DQ5: U42.H9(DQ5)
DDR2.DQ6: U42.F1(DQ6)
DDR2.DQ7: U42.F9(DQ7)
DDR2.DQ8: U42.C8(DQ8)
DDR2.DQ9: U42.C2(DQ9)
DDR2.DQ10: U42.D7(DQ10)
DDR2.DQ11: U42.D3(DQ11)
DDR2.DQ12: U42.D1(DQ12)
DDR2.DQ13: U42.D9(DQ13)
DDR2.DQ14: U42.B1(DQ14)
DDR2.DQ15: U42.B9(DQ15)
DDR2.DQ16: U43.G8(DQ0)
DDR2.DQ17: U43.G2(DQ1)
DDR2.DQ18: U43.H7(DQ2)
DDR2.DQ19: U43.H3(DQ3)
DDR2.DQ20: U43.H1(DQ4)
DDR2.DQ21: U43.H9(DQ5)
DDR2.DQ22: U43.F1(DQ6)
DDR2.DQ23: U43.F9(DQ7)
DDR2.DQ24: U43.C8(DQ8)
DDR2.DQ25: U43.C2(DQ9)
DDR2.DQ26: U43.D7(DQ10)
DDR2.DQ27: U43.D3(DQ11)
DDR2.DQ28: U43.D1(DQ12)
DDR2.DQ29: U43.D9(DQ13)
DDR2.DQ30: U43.B1(DQ14)
DDR2.DQ31: U43.B9(DQ15)
DDR2.DQ32: U44.G8(DQ0)
DDR2.DQ33: U44.G2(DQ1)
DDR2.DQ34: U44.H7(DQ2)
DDR2.DQ35: U44.H3(DQ3)
DDR2.DQ36: U44.H1(DQ4)
DDR2.DQ37: U44.H9(DQ5)
DDR2.DQ38: U44.F1(DQ6)
DDR2.DQ39: U44.F9(DQ7)
DDR2.DQ40: U44.C8(DQ8)
DDR2.DQ41: U44.C2(DQ9)
DDR2.DQ42: U44.D7(DQ10)
DDR2.DQ43: U44.D3(DQ11)
DDR2.DQ44: U44.D1(DQ12)
DDR2.DQ45: U44.D9(DQ13)
DDR2.DQ46: U44.B1(DQ14)
DDR2.DQ47: U44.B9(DQ15)
DDR2.DQ48: U45.G8(DQ0)
DDR2.DQ49: U45.G2(DQ1)
DDR2.DQ50: U45.H7(DQ2)
DDR2.DQ51: U45.H3(DQ3)
DDR2.DQ52: U45.H1(DQ4)
DDR2.DQ53: U45.H9(DQ5)
DDR2.DQ54: U45.F1(DQ6)
DDR2.DQ55: U45.F9(DQ7)
DDR2.DQ56: U45.C8(DQ8)
DDR2.DQ57: U45.C2(DQ9)
DDR2.DQ58: U45.D7(DQ10)
DDR2.DQ59: U45.D3(DQ11)
DDR2.DQ60: U45.D1(DQ12)
DDR2.DQ61: U45.D9(DQ13)
DDR2.DQ62: U45.B1(DQ14)
DDR2.DQ63: U45.B9(DQ15)
DDR2.DQS0: U42.F7(LDQS)
DDR2.DQS1: U42.B7(UDQS)
DDR2.DQS2: U43.F7(LDQS)
DDR2.DQS3: U43.B7(UDQS)
DDR2.DQS4: U44.F7(LDQS)
DDR2.DQS5: U44.B7(UDQS)
DDR2.DQS6: U45.F7(LDQS)
DDR2.DQS7: U45.B7(UDQS)
DDR2.ODT: U42.K9(ODT) U43.K9(ODT) U44.K9(ODT) U45.K9(ODT) ; port DDR2.ODT
DDR2.RASn: U42.K7(RASn) U43.K7(RASn) U44.K7(RASn) U45.K7(RASn) ; port DDR2.RASn
DDR2.Sn: U42.L8(CSn) U43.L8(CSn) U44.L8(CSn) U45.L8(CSn) ; port DDR2.Sn
DDR2.WEn: U42.K3(WEn) U43.K3(WEn) U44.K3(WEn) U45.K3(WEn) ; port DDR2.WEn

Not connected (* = marked no-connect by the designer): U42 A2(NC)* A8(UDQSn)* E2(NC)* E8(LDQSn)* R3(RFU)* R7(RFU)*; U43 A2(NC)* A8(UDQSn)* E2(NC)* E8(LDQSn)* R3(RFU)* R7(RFU)*; U44 A2(NC)* A8(UDQSn)* E2(NC)* E8(LDQSn)* R3(RFU)* R7(RFU)*; U45 A2(NC)* A8(UDQSn)* E2(NC)* E8(LDQSn)* R3(RFU)* R7(RFU)*

### Buses and harness runs
bus DDR2.A[13..0]
bus DDR2.BA[2..0]
bus DDR2.CLK_N[3..0]
bus DDR2.CLK_P[3..0]
bus DDR2.DM[7..0]
bus DDR2.DQ[63..0]
bus DDR2.DQS[7..0]

### Notes on the sheet
- 2009   THIS DOCUMENT IS THE PROPERTY OF THE OWNER, AND MAY NOT BE COPIED OR USED FOR ANY PURPOSE OTHER THAN THAT FOR WHICH IT IS SUPPLIED WITHOUT PERMISSION IN WRITING FROM THE OWNER.
- C
- DATESTAMP OF THIS PRINT
- DRAWN BY:
- DOCUMENT NUMBER:
- SCHEMATIC FILENAME:
- PCB FILENAME:
- ENGINEER:
- APPROVED:
- CIRCUIT DIAGRAM
- DATE
- SHEET
- REVISION
- OF

### Library data of the parts
C222 C223 C225-C233 C235-C243 C245-C253 C255-C261 C364 C372 C406 C407 = CAP-CER-1: as C681-C684 on sheet v6_net; POD number: CAP-CER-1; Value: 0.1uF; RoHS: Y; Sort Value: 0.1; Category: Capacitors; Subcategory: Ceramic
C224 C234 C244 C254 = CAP-CER-5: as C679 on sheet v6_net; POD number: CAP-CER-5; Value: 10uF; RoHS: Y; Sort Value: 100; Category: Capacitors; Subcategory: Ceramic
U42-U45 = IC-MEM-2: 2Gb, x16, BGA84 DDR2 SDRAM IC; Manufacturer: Micron; POD number: IC-MEM-2; PartNum: MT47H128M16; RoHS: Y; Category: IC; Subcategory: Memory

## Sheet misc.SchDoc: Miscellaneous Design Items
size A3; Date: DO NOT USE, RATHER USE PROJ OPTIONS; DrawnBy: DO NOT USE, RATHER USE PROJ OPTIONS; Engineer: DO NOT USE, RATHER USE PROJ OPTIONS; Organization: DO NOT USE, RATHER USE PROJ OPTIONS; DocumentNumber: DO NOT USE, RATHER USE PROJ OPTIONS; Revision: DO NOT USE, RATHER USE PROJ OPTIONS; SheetNumber: 27; SheetTotal: 27; SCH_Sheet_Filename: misc.SchDoc; CurrentTime: DO NOT USE, RATHER USE PROJ OPTIONS; Time: DO NOT USE, RATHER USE PROJ OPTIONS; DocumentFullPathAndName: DO NOT USE, RATHER USE PROJ OPTIONS; DocumentName: DO NOT USE, RATHER USE PROJ OPTIONS; ModifiedDate: DO NOT USE, RATHER USE PROJ OPTIONS; ImagePath: DO NOT USE, RATHER USE PROJ OPTIONS
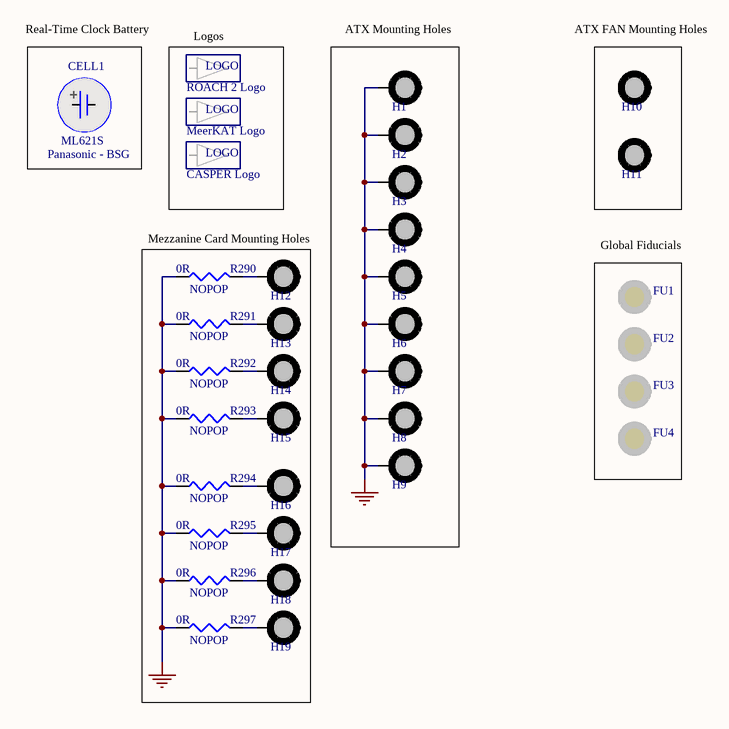
[diagram p24: misc.SchDoc]

### Parts
CELL1  Manufacturer: Panasonic - BSG  (hidden comment: ML621S)  (mechanical)
FU1  FIDUCIAL  [FIDUCIAL_1MM]  (value not drawn)  (no BOM)
FU2  FIDUCIAL  [FIDUCIAL_1MM]  (value not drawn)  (no BOM)
FU3  FIDUCIAL  [FIDUCIAL_1MM]  (value not drawn)  (no BOM)
FU4  FIDUCIAL  [FIDUCIAL_1MM]  (value not drawn)  (no BOM)
H1  MH_ATX  [MH_ATX]  (value not drawn)  (no BOM)
H2  MH_ATX  [MH_ATX]  (value not drawn)  (no BOM)
H3  MH_ATX  [MH_ATX]  (value not drawn)  (no BOM)
H4  MH_ATX  [MH_ATX]  (value not drawn)  (no BOM)
H5  MH_ATX  [MH_ATX]  (value not drawn)  (no BOM)
H6  MH_ATX  [MH_ATX]  (value not drawn)  (no BOM)
H7  MH_ATX  [MH_ATX]  (value not drawn)  (no BOM)
H8  MH_ATX  [MH_ATX]  (value not drawn)  (no BOM)
H9  MH_ATX  [MH_ATX]  (value not drawn)  (no BOM)
H10  MH_NC  [MH_FANATX]  (value not drawn)  (no BOM)
H11  MH_NC  [MH_FANATX]  (value not drawn)  (no BOM)
H12  MH_ATX  [MH_ATX]  (value not drawn)  (no BOM)
H13  MH_ATX  [MH_ATX]  (value not drawn)  (no BOM)
H14  MH_ATX  [MH_ATX]  (value not drawn)  (no BOM)
H15  MH_ATX  [MH_ATX]  (value not drawn)  (no BOM)
H16  MH_ATX  [MH_ATX]  (value not drawn)  (no BOM)
H17  MH_ATX  [MH_ATX]  (value not drawn)  (no BOM)
H18  MH_ATX  [MH_ATX]  (value not drawn)  (no BOM)
H19  MH_ATX  [MH_ATX]  (value not drawn)  (no BOM)
LOGO1  ROACH 2 Logo  [ROACH2_LOGO]  (no BOM)
LOGO2  MeerKAT Logo  [MEERKAT_LOGO]  (no BOM)
LOGO3  CASPER Logo  [CASPER_LOGO]  (no BOM)
R290  0R  [RESC1005X40L]
R291  0R  [RESC1005X40L]
R292  0R  [RESC1005X40L]
R293  0R  [RESC1005X40L]
R294  0R  [RESC1005X40L]
R295  0R  [RESC1005X40L]
R296  0R  [RESC1005X40L]
R297  0R  [RESC1005X40L]

### Nets
GND: H1.1 H2.1 H3.1 H4.1 H5.1 H6.1 H7.1 H8.1 H9.1 R290.1 R291.1 R292.1 R293.1 R294.1 R295.1 R296.1 R297.1
NetH12_1: H12.1 R290.2
NetH13_1: H13.1 R291.2
NetH14_1: H14.1 R292.2
NetH15_1: H15.1 R293.2
NetH16_1: H16.1 R294.2
NetH17_1: H17.1 R295.2
NetH18_1: H18.1 R296.2
NetH19_1: H19.1 R297.2

### Notes on the sheet
- Real-Time Clock Battery
- (near LOGO1) Logos
- (near H1) ATX Mounting Holes
- (near H10) ATX FAN Mounting Holes
- Mezzanine Card Mounting Holes
- (near FU1) Global Fiducials
- (near R290) NOPOP
- (near R291) NOPOP
- (near R292) NOPOP
- (near R293) NOPOP
- (near R294) NOPOP
- (near R295) NOPOP
- (near R296) NOPOP
- (near R297) NOPOP
- 2009   THIS DOCUMENT IS THE PROPERTY OF THE OWNER, AND MAY NOT BE COPIED OR USED FOR ANY PURPOSE OTHER THAN THAT FOR WHICH IT IS SUPPLIED WITHOUT PERMISSION IN WRITING FROM THE OWNER.
- C
- DATESTAMP OF THIS PRINT
- DRAWN BY:
- DOCUMENT NUMBER:
- SCHEMATIC FILENAME:
- PCB FILENAME:
- ENGINEER:
- APPROVED:
- CIRCUIT DIAGRAM
- DATE
- SHEET
- REVISION
- OF

### Library data of the parts
CELL1 = ELMECH-BAT-0: 3V,  6.8mm Mangenese Lithium Battery; POD number: ELMECH-BAT-0; PartNum: ML621S; RoHS: Y; Value: 3V; Category: ELMECH; Subcategory: Batteries
FU1-FU4 = MECH-FU-1: 1mm Fiducial mark; POD number: MECH-FU-1; RoHS: Y; Category: MECH; Subcategory: Fiducial
H1-H9 H12-H19 = ELMECH-MH-0: 3.81mm Diameter, ATX mounting hole; POD number: ELMECH-MH-0; RoHS: Y; Category: ELMECH; Subcategory: Mounting Holes
H10 H11 = ELMECH-MH-1: 3.2mm Diameter, Unplated, Floating mounting Hole; POD number: ELMECH-MH-1; RoHS: Y; Category: ELMECH; Subcategory: Mounting Holes
LOGO1 = GRAPH-LOGO-0: POD number: GRAPH-LOGO-0; RoHS: Y; Category: GRAPH; Subcategory: Logo
LOGO2 = GRAPH-LOGO-1: POD number: GRAPH-LOGO-1; RoHS: Y; Category: GRAPH; Subcategory: Logo
LOGO3 = GRAPH-LOGO-2: POD number: GRAPH-LOGO-2; RoHS: Y; Category: GRAPH; Subcategory: Logo
R290-R297 = RES-TF-0: as R223 on sheet v6_net; POD number: RES-TF-0; Value: 0R; Sort Value: 0; Category: Resistors; Subcategory: ThickFilm; HelpURL: *.pdf